# Altium schematic sheet GSM - BGS2.SchDoc
size A4
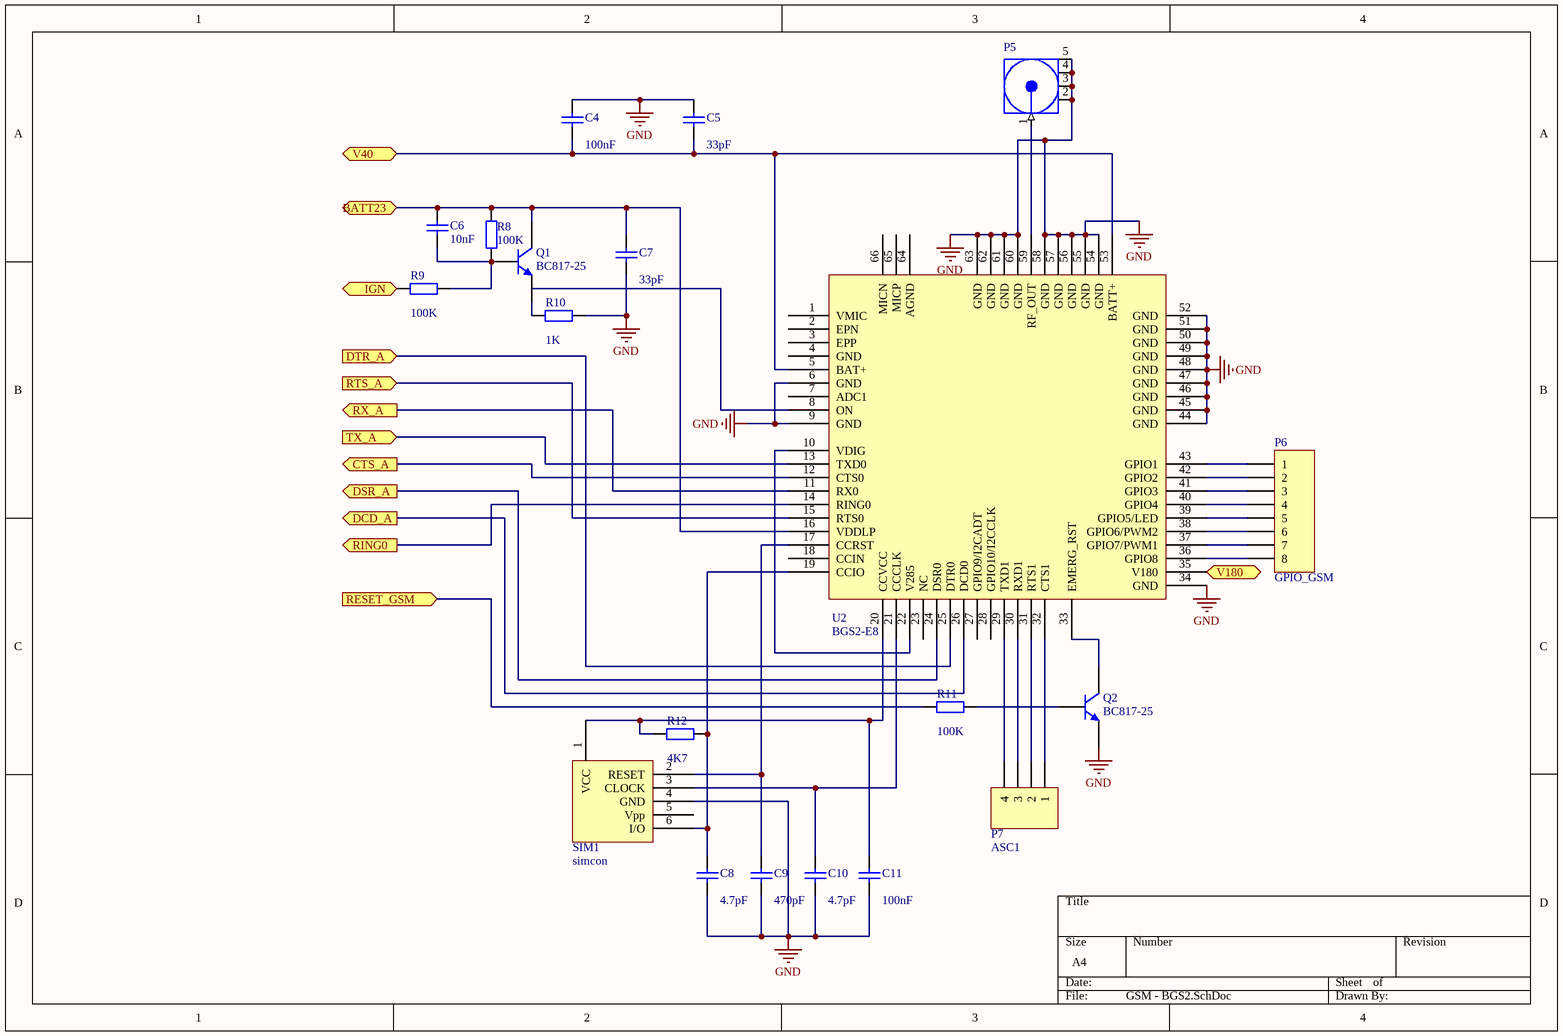
[diagram p0: GSM - BGS2.SchDoc]

## Parts
C4  value 100nF  [RAD-0.1]  (hidden comment: Cap)
C5  value 33pF  [RAD-0.1]  (hidden comment: Cap)
C6  value 10nF  [RAD-0.1]  (hidden comment: Cap)
C7  value 33pF  [RAD-0.1]  (hidden comment: Cap)
C8  value 4.7pF  [RAD-0.1]  (hidden comment: Cap)
C9  value 470pF  [RAD-0.1]  (hidden comment: Cap)
C10  value 4.7pF  [RAD-0.1]  (hidden comment: Cap)
C11  value 100nF  [RAD-0.1]  (hidden comment: Cap)
P5  COAX-M  [MCX5.08-H5]  (value not drawn)
P6  GPIO_GSM  [HDR1X8H]
P7  ASC1  [HDR1X4H]
Q1  BC817-25  [SOT-23A]
Q2  BC817-25  [SOT-23A]
R8  value 100K  [AXIAL-0.4]  (hidden comment: Res2)
R9  value 100K  [AXIAL-0.4]  (hidden comment: Res2)
R10  value 1K  [AXIAL-0.4]  (hidden comment: Res2)
R11  value 100K  [AXIAL-0.4]  (hidden comment: Res2)
R12  value 4K7  [AXIAL-0.4]  (hidden comment: Res2)
SIM1  simcon  [SIMCON-6pin]
U2  BGS2-E8  [QFN120P2700X1820X270-66M]

## Ports
BATT23, CTS_A (out), DCD_A (out), DSR_A (out), DTR_A (in), IGN (in), RESET_GSM (in), RING0 (out), RTS_A (in), RX_A (out), TX_A (in), V40, V180 (out)

## Nets
GND: C4.2 C5.2 C7.2 C8.1 C9.1 C10.1 C11.1 P5.2(GND) P5.3(GND) P5.4(GND) P5.5(GND) Q2.2(E) R10.2 SIM1.4(GND) U2.6(GND) U2.9(GND) U2.34(GND) U2.44(GND) U2.45(GND) U2.46(GND) U2.47(GND) U2.48(GND) U2.49(GND) U2.50(GND) U2.51(GND) U2.52(GND) U2.54(GND) U2.55(GND) U2.56(GND) U2.57(GND) U2.58(GND) U2.60(GND) U2.61(GND) U2.62(GND) U2.63(GND)
BATT23: C6.2 C7.1 Q1.3(C) R8.2 U2.16(VDDLP) ; port BATT23
CTS_A: U2.12(CTS0) ; port CTS_A
DCD_A: U2.26(DCD0) ; port DCD_A
DSR_A: U2.24(DSR0) ; port DSR_A
DTR_A: U2.25(DTR0) ; port DTR_A
IGN: R9.1 ; port IGN
RESET_GSM: R11.1 ; port RESET_GSM
RING0: U2.14(RING0) ; port RING0
RTS_A: U2.15(RTS0) ; port RTS_A
RX_A: U2.11(RX0) ; port RX_A
TX_A: U2.13(TXD0) ; port TX_A
V40: C4.1 C5.1 U2.5(BAT+) U2.53(BATT+) ; port V40
V180: U2.35(V180) ; port V180
NetC6_1: C6.1 Q1.1(B) R8.1 R9.2
NetC8_2: C8.2 R12.2 SIM1.6(I/O) U2.19(CCIO)
NetC9_2: C9.2 SIM1.2(RESET) U2.17(CCRST)
NetC10_2: C10.2 SIM1.3(CLOCK) U2.21(CCCLK)
NetC11_2: C11.2 R12.1 SIM1.1(VCC) U2.20(CCVCC)
NetP5_1: P5.1(Signal) U2.59(RF_OUT)
NetP6_1: P6.1 U2.43(GPIO1)
NetP6_2: P6.2 U2.42(GPIO2)
NetP6_3: P6.3 U2.41(GPIO3)
NetP6_4: P6.4 U2.40(GPIO4)
NetP6_5: P6.5 U2.39(GPIO5/LED)
NetP6_6: P6.6 U2.38(GPIO6/PWM2)
NetP6_7: P6.7 U2.37(GPIO7/PWM1)
NetP6_8: P6.8 U2.36(GPIO8)
NetP7_1: P7.1 U2.32(CTS1)
NetP7_2: P7.2 U2.31(RTS1)
NetP7_3: P7.3 U2.30(RXD1)
NetP7_4: P7.4 U2.29(TXD1)
NetQ1_2: Q1.2(E) R10.1
NetQ2_1: Q2.1(B) R11.2
NetQ2_3: Q2.3(C) U2.33(EMERG_RST)
NetU2_10: U2.10(VDIG) U2.22(V285)

Not connected (* = marked no-connect by the designer): SIM1 5(Vpp); U2 1(VMIC) 2(EPN) 3(EPP) 4(GND) 7(ADC1) 8(ON) 18(CCIN) 23(NC) 27(GPIO9/I2CADT) 28(GPIO10/I2CCLK) 64(AGND) 65(MICP) 66(MICN)

## Library data of the parts
C4-C11 = Cap: Capacitor; Published: 8-Jun-2000; LatestRevisionDate: 17-Jul-2002; LatestRevisionNote: Re-released for DXP Platform.; PackageReference: RAD-0.3; Publisher: Altium Limited; PackageDescription: Radial Cap, Thru-Hole; 2 Leads; 0.3 in Pin Spacing
P5 = COAX-M: RF Coaxial PCB Connector, MMCX; Thru-Hole, Vertical Mount Plug,  50 Ohm Impedance; PackageDocument: Rev. A, 16-Jun-1997; PCB_Layout: Complies with manufacturer's recommendation.; DrillSize: Corresponds to nominal value.; Published: 15-Jul-2004; LatestRevisionDate: 15-Jul-2004; LatestRevisionNote: Component Replaced.; DatasheetDocument: 30-May-2003; PackageReference: 908-21103; Publisher: Altium Limited; ComponentLink1Description: Manufacturer Link; ComponentLink1URL: http://www.amphenolrf.com/
P6 = Header 8H: Header, 8-Pin, Right Angle; LatestRevisionDate: 17-Jul-2002; LatestRevisionNote: Re-released for DXP Platform.; Publisher: Altium Limited
P7 = Header 4H: Header, 4-Pin, Right Angle; LatestRevisionDate: 17-Jul-2002; LatestRevisionNote: Re-released for DXP Platform.; Publisher: Altium Limited
Q1 Q2 = BC817-25: NPN General Purpose Amplifier; Published: 8-Jun-2000; LatestRevisionDate: 17-Jul-2002; LatestRevisionNote: Re-released for DXP Platform.; DatasheetDocument: 1997; PackageDocument: Sep-1998; PackageReference: SOT-23A; Publisher: Altium Limited; ComponentLink1Description: Manufacturer Link; ComponentLink1URL: http://www.fairchildsemi.com/; ComponentLink2Description: Discontinuation Notice; ComponentLink2URL: http://www.fairchildsemi.com/obsolete/obs.jsp
R8-R12 = Res2: Resistor; Published: 8-Jun-2000; LatestRevisionDate: 17-Jul-2002; LatestRevisionNote: Re-released for DXP Platform.; PackageReference: AXIAL-0.4; Publisher: Altium Limited; PackageDescription: Axial Device, Thru-Hole; 2 Leads; 0.4 in Pin Spacing